# EAGLE design kombi_4x16Arelais01 (EAGLE 4.16)
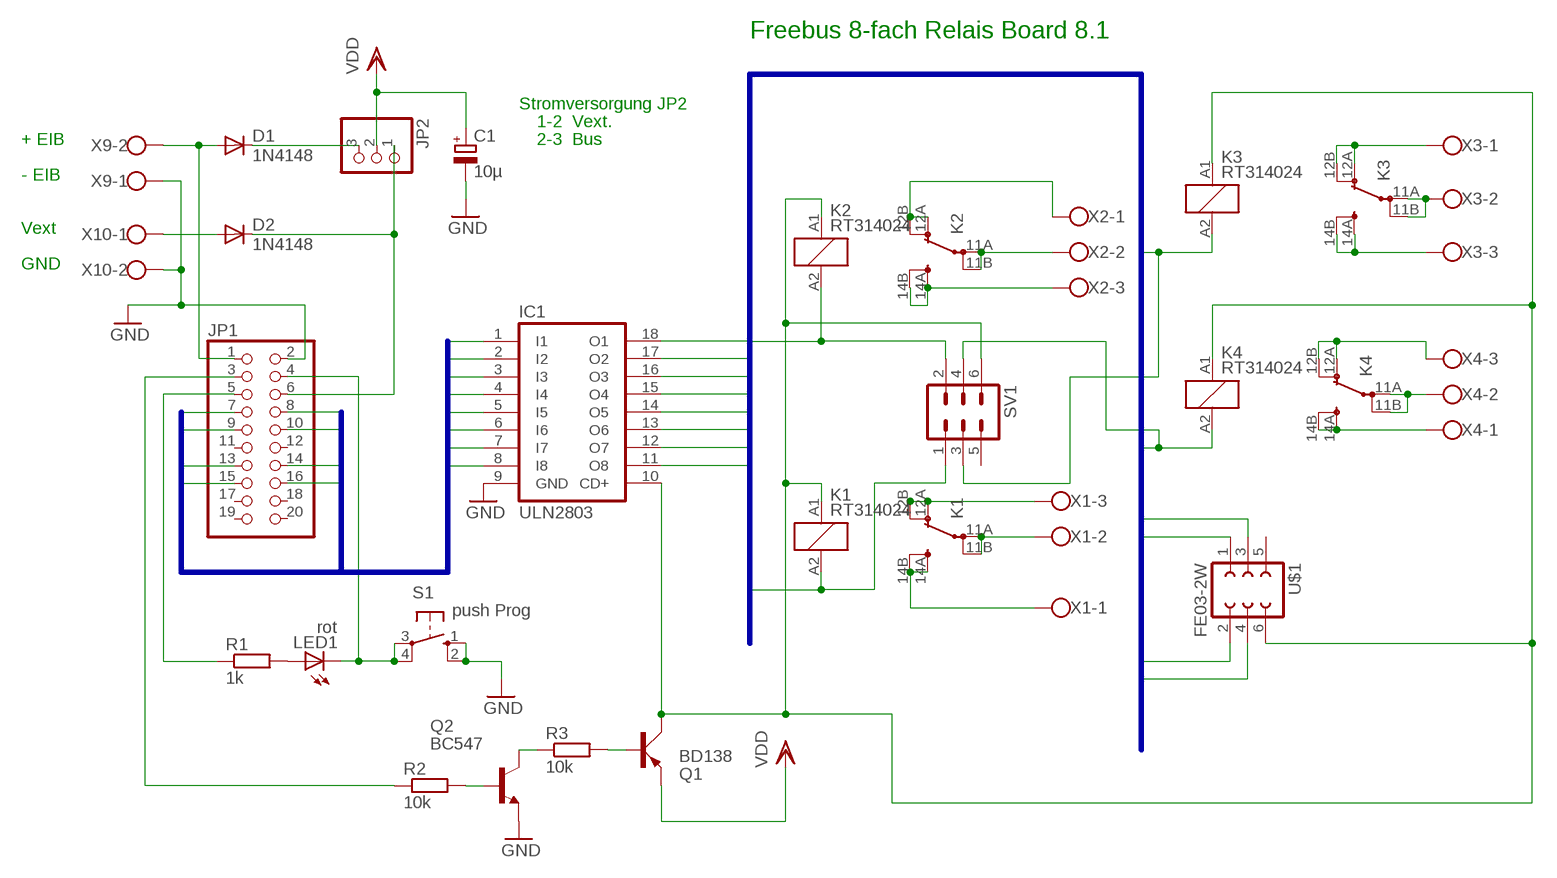
[diagram p0: schematic, sheet 1]

## Parts
C1  10µ  CPOL-EUE3.5-8  [E3,5-8]
D1  1N4148  [DO35-10]
D2  1N4148  [DO35-10]
IC1  ULN2803  ULN2803A  [DIL18]
JP1  PINHD-2X10  [2X10]
JP2  PINHD-1X3  [1X03]
K1  RT314024  [RT-C/O16A5]
K2  RT314024  [RT-C/O16A5]
K3  RT314024  [RT-C/O16A5]
K4  RT314024  [RT-C/O16A5]
LED1  rot  LED3MM  [LED3MM]
Q1  BD138  BD140  [TO126AV]
Q2  BC547  [TO92]
R1  1k  R-EU_0207/10  [0207/10]
R2  10k  R-EU_0207/10  [0207/10]
R3  10k  R-EU_0207/10  [0207/10]
S1  push Prog  10-XX  [B3F-10XX]
SV1  MA03-2LIEGEND  [MA03-2W]
U$1  FE03-2W  [FE03-2W]
X1  W237-03P  [W237-133]
X2  W237-03P  [W237-133]
X3  W237-03P  [W237-133]
X4  W237-03P  [W237-133]
X9  W237-102  [W237-102]
X10  W237-102  [W237-102]

## Nets
GND: C1.- IC1.9(GND) JP1.2 Q2.1(E) S1.1(S) S1.2(S1) X9.1 X10.2
IO1: IC1.1(I1) JP1.16
IO2: IC1.2(I2) JP1.15
IO3: IC1.3(I3) JP1.14
IO4: IC1.4(I4) JP1.13
IO5: IC1.5(I5) JP1.10
IO6: IC1.6(I6) JP1.9
IO7: IC1.7(I7) JP1.8
IO8: IC1.8(I8) JP1.7
N$7: K3.12A(2:OA) K3.12B(2:OB) X3.1
N$8: K4.14A(2:SA) K4.14B(2:SB) X4.1
N$9: K4.11A(2:PA) K4.11B(2:PB) X4.2
N$10: K4.12A(2:OA) K4.12B(2:OB) X4.3
N$11: K3.11A(2:PA) K3.11B(2:PB) X3.2
N$12: K3.14A(2:SA) K3.14B(2:SB) X3.3
N$13: K1.12A(2:OA) K1.12B(2:OB) X1.3
N$14: K1.11A(2:PA) K1.11B(2:PB) X1.2
N$15: K1.14A(2:SA) K1.14B(2:SB) X1.1
N$16: K2.14A(2:SA) K2.14B(2:SB) X2.3
N$17: D2.A X10.1
N$18: K2.11A(2:PA) K2.11B(2:PB) X2.2
N$19: K2.12A(2:OA) K2.12B(2:OB) X2.1
N$20: D1.A JP1.1 X9.2
N$24: JP1.5 R1.1
N$27: JP1.4 LED1.K(C) S1.3(P) S1.4(P1)
N$28: LED1.A R1.2
N$31: D2.C JP1.6 JP2.1
N$32: D1.C JP2.3
N$33: JP1.3 R2.1
N$37: Q1.B R3.2
N$38: Q2.3(C) R3.1
N$39: Q2.2(B) R2.2
PWM_RELAISE: IC1.10(CD+) K1.A1 K2.A1 K3.A1 K4.A1 Q1.C SV1.6 U$1.6
R1: IC1.14(O5) U$1.4
R2: IC1.13(O6) U$1.3
R3: IC1.12(O7) U$1.2
R4: IC1.11(O8) U$1.1
R5: IC1.15(O4) K4.A2 SV1.4
R6: IC1.16(O3) K3.A2 SV1.3
R7: IC1.17(O2) K2.A2 SV1.2
R8: IC1.18(O1) K1.A2 SV1.1
VDD: C1.+ JP2.2 Q1.E
Unconnected: JP1.11 JP1.12 JP1.17 JP1.18 JP1.19 JP1.20 SV1.5 U$1.5

## Buses
R[1..8]
IO[1..8]

## Notes on the sheet
- Freebus 8-fach Relais Board 8.1
- Stromversorgung JP2
- 1-2  Vext.
- + EIB | 2-3  Bus
- - EIB
- Vext
- GND

## Library data of the parts
C1 = rcl:CPOL-EU: POLARIZED CAPACITOR, European symbol
D1 D2 = diode:1N4148: DIODE high speed (Philips)
IC1 = uln-udn:ULN2803A: DRIVER ARRAY
JP1 = pinhead:PINHD-2X10: PIN HEADER
JP2 = pinhead:PINHD-1X3: PIN HEADER
K1-K4 = freebus_relay:RT31*: Power PCB Relayl SCHRACK 1 pole 12 / 16 A, DC- or AC-coi Source: http://www.schrack.com/.. 5819.pdf
LED1 = led:LED: LED OSRAM: - CHIPLED LG R971, LG N971, LY N971, LG Q971, LY Q971, LO R971, LY R971 LH N974, LH R974 LS Q976, LO Q976, LY Q976 LO Q996 - Hyper CHIPLED LW Q18S LB Q993, LB Q99A, LB R99A - SideLED LS A670, LO A670, LY A670, LG A670, LP A670 LB A673, LV A673, LT A673, LW A673 LH A674 LY A675 LS A676, LA A676, LO A676, LY A676, LW A676 LS A679, LY A679, LG A679 - Hyper Micro SIDELED® LS Y876, LA Y876, LO Y876, LY Y876 LT Y87S - SmartLED LW L88C, LW L88S LB L89C, LB L89S, LG L890 LS L89K, LO L89K, LY L89K LS L896, LA L896, LO L896, LY L896 - TOPLED LS T670, LO T670, LY T670, LG T670, LP T670 LSG T670, LSP T670, LSY T670, LOP T670, LYG T670 LG T671, LOG T671, LSG T671 LB T673, LV T673, LT T673, LW T673 LH T674 LS T676, LA T676, LO T676, LY T676, LB T676, LH T676, LSB T676, LW T676 LB T67C, LV T67C, LT T67C, LS T67K, LO T67K, LY T67K, LW E67C LS E67B, LA E67B, LO E67B, LY E67B, LB E67C, LV E67C, LT E67C LW T67C LS T679, LY T679, LG T679 LS T770, LO T770, LY T770, LG T770, LP T770 LB T773, LV T773, LT T773, LW T773 LH T774 LS E675, LA E675, LY E675, LS T675 LS T776, LA T776, LO T776, LY T776, LB T776 LHGB T686 LT T68C, LB T68C - Hyper Mini TOPLED® LB M676 - Mini TOPLED Santana® LG M470 LS M47K, LO M47K, LY M47K Source: http://www.osram.convergy.de - LUMILED® LXK2-PW12-R00, LXK2-PW12-S00, LXK2-PW14-U00, LXK2-PW14-V00 LXK2-PM12-R00, LXK2-PM12-S00, LXK2-PM14-U00 LXK2-PE12-Q00, LXK2-PE12-R00, LXK2-PE12-S00, LXK2-PE14-T00, LXK2-PE14-U00 LXK2-PB12-K00, LXK2-PB12-L00, LXK2-PB12-M00, LXK2-PB14-N00, LXK2-PB14-P00, LXK2-PB14-Q00 LXK2-PR12-L00, LXK2-PR12-M00, LXK2-PR14-Q00, LXK2-PR14-R00 LXK2-PD12-Q00, LXK2-PD12-R00, LXK2-PD12-S00 LXK2-PH12-R00, LXK2-PH12-S00 LXK2-PL12-P00, LXK2-PL12-Q00, LXK2-PL12-R00 Source: www.luxeon.com
Q1 = transistor-power:BD140: PNP TRANSISTOR
Q2 = transistor-npn:BC547*: NPN Transistor
R1-R3 = rcl:R-EU_: RESISTOR, European symbol
S1 = switch-omron:10-XX: OMRON SWITCH
SV1 = con-lstb:MA03-2: PIN HEADER
U$1 = con-lsta:FE03-2W
X1-X4 = con-wago-508:W237-03P: WAGO SREW CLAMP
X9 X10 = con-wago-500:W237-102: WAGO SCREW CLAMP

## Board
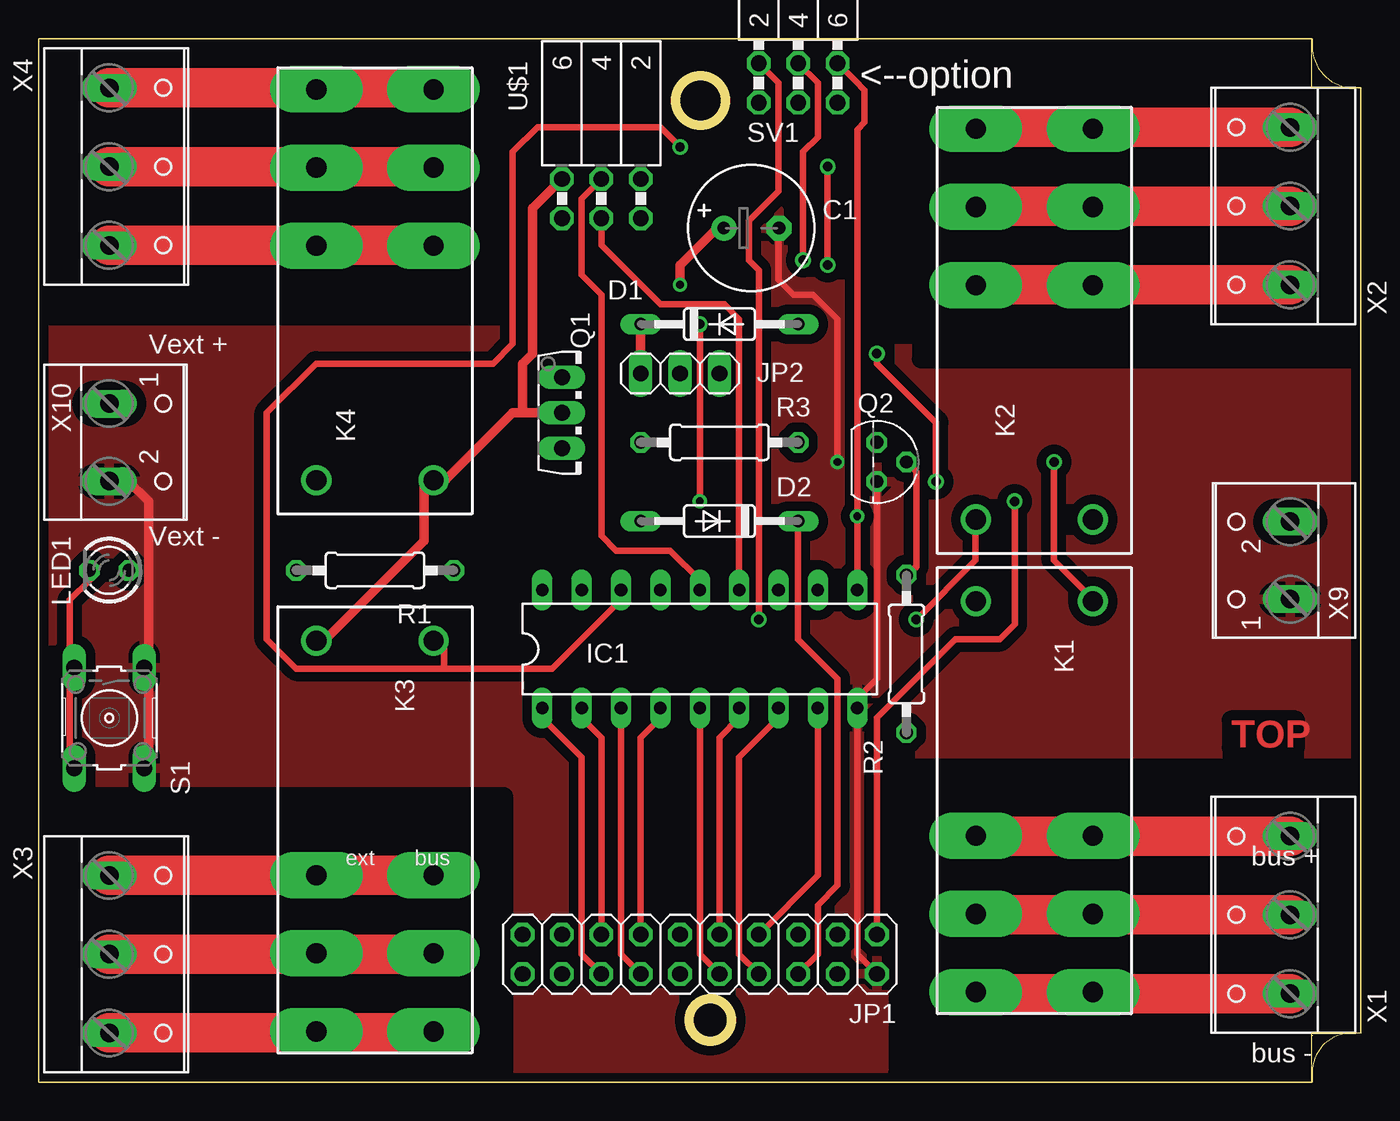
[diagram p1: board, top side]
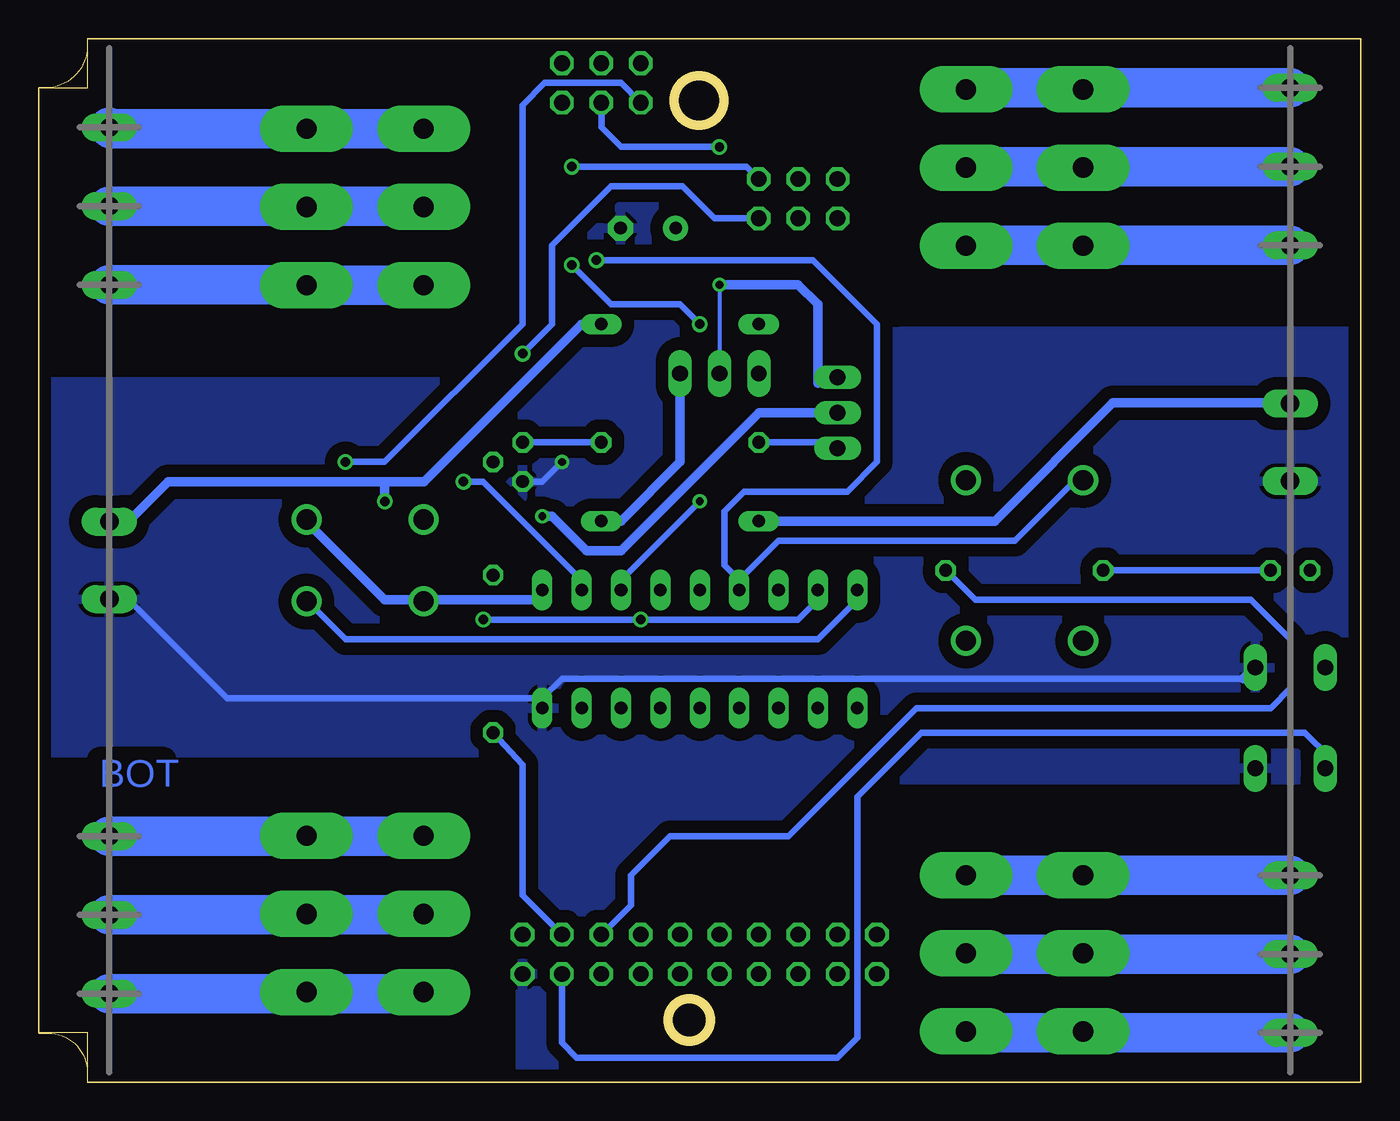
[diagram p2: board, bottom side, seen from below]

Size 85.3 x 67.3 mm. Coordinates in mm from the lower left corner, seen from the top.
Outline: 0,0.01 82.16,0 82.16,3.18 85.3,3.18 85.3,64.13 82.16,64.13 82.16,67.3 0,67.3 0,0.01
Outline: circle at 42.7,63.33 radius 1.59
Outline: circle at 43.33,4 radius 1.35
Copper layers (1*16): Top 0.035mm / dielectric 1.5mm / Bottom 0.035mm
Design rules "default": minimum track width 10mil, minimum drill 24mil, track to track 16mil, track to pad 12mil, pad to pad 16mil, via to via 16mil, smd to smd 8mil, copper to edge 20mil, drill to drill 10mil, minimum pad ring 10mil, minimum via ring 8mil, stop-mask expansion 4mil, vias tented up to drill 0mil, thermal gap 10mil
tRestrict: area -0.5,49.4 to 29.9,67.2; area 55.3,48.3 to 85.2,66.7; area 0.2,0.6 to 30,18.4; area 55.4,0.6 to 85.3,18.4; area 55.3,18.1 to 85.1,20.3; area 56.9,46.7 to 85.1,49.2
bRestrict: area -0.5,49.5 to 29.9,67.3; area 55.3,48.3 to 85.2,66.7; area 55.4,0.6 to 85.2,18.3; area 0,0.6 to 29.9,18.4; area 56.8,46.3 to 84.8,49.2; area 55.3,18 to 85.2,20.2
Milling: 15 lines

### Footprints (pad centres in the part's own frame; a part is rotated, then mirrored left to right if it is on the bottom)
E3,5-8 = drill 0.813 pad 1.6 round: + -1.778,0 | drill 0.813 pad 1.6 octagon: - 1.778,0
DO35-10 = drill 0.813 long: A 5.08,0; C -5.08,0
DIL18 = drill 0.813 long: 1 -10.16,-3.81; 2 -7.62,-3.81; 3 -5.08,-3.81; 4 -2.54,-3.81; 5 0,-3.81; 6 2.54,-3.81; 7 5.08,-3.81; 8 7.62,-3.81; 9 10.16,-3.81; 10 10.16,3.81; 11 7.62,3.81; 12 5.08,3.81; 13 2.54,3.81; 14 0,3.81; 15 -2.54,3.81; 16 -5.08,3.81; 17 -7.62,3.81; 18 -10.16,3.81
2X10 = drill 1.016 octagon: 1 -11.43,-1.27; 2 -11.43,1.27; 3 -8.89,-1.27; 4 -8.89,1.27; 5 -6.35,-1.27; 6 -6.35,1.27; 7 -3.81,-1.27; 8 -3.81,1.27; 9 -1.27,-1.27; 10 -1.27,1.27; 11 1.27,-1.27; 12 1.27,1.27; 13 3.81,-1.27; 14 3.81,1.27; 15 6.35,-1.27; 16 6.35,1.27; 17 8.89,-1.27; 18 8.89,1.27; 19 11.43,-1.27; 20 11.43,1.27
1X03 = drill 1.016 long: 1 -2.54,0; 2 0,0; 3 2.54,0
RT-C/O16A5 = drill 1.3 pad 3 long: 11A 7.56,3.78; 11B 7.56,-3.78; 12A 2.52,3.78; 12B 2.52,-3.78; 14A 12.6,3.78; 14B 12.6,-3.78 | drill 1.3 round: A1 -12.6,-3.78; A2 -12.6,3.78
LED3MM = drill 0.813 octagon: A -1.27,0; K 1.27,0
TO126AV = drill 1.016 long: B 2.286,-1.27; C 0,-1.27; E -2.286,-1.27
TO92 = drill 0.813 octagon: 1 1.27,0; 2 0,1.905; 3 -1.27,0
0207/10 = drill 0.813 octagon: 1 -5.08,0; 2 5.08,0
B3F-10XX = drill 1.016 long: 1 -3.251,2.261; 2 3.251,2.261; 3 -3.251,-2.261; 4 3.251,-2.261
MA03-2W = drill 1.016 octagon: 1 -2.54,-5.08; 2 -2.54,-2.54; 3 0,-5.08; 4 0,-2.54; 5 2.54,-5.08; 6 2.54,-2.54
FE03-2W = drill 1.016 octagon: 1 5.08,-5.08; 2 5.08,-2.54; 3 2.54,-5.08; 4 2.54,-2.54; 5 0,-5.08; 6 0,-2.54
W237-133 = drill 1.194 long: 1 -5.08,-0.635; 2 0,-0.635; 3 5.08,-0.635
W237-102 = drill 1.194 long: 1 -2.5,-1.27; 2 2.5,-1.27

### Placement (x,y rotation side)
C1  45.98,55.09 0 top
D1  43.92,48.89 0 top
D2  43.92,36.2 180 top
IC1  42.65,27.94 0 top
JP1  42.65,8.26 180 top
JP2  41.38,45.72 180 top
K1  64.24,18.42 270 top
K2  64.24,48.89 90 top
K3  21.7,15.88 270 top
K4  21.7,51.43 90 top
LED1  4.55,33.02 180 top
Q1  35.03,43.18 270 top
Q2  54.08,40 270 top
R1  21.7,33.02 180 top
R2  55.98,27.62 90 top
R3  43.92,41.27 180 top
S1  4.55,23.5 270 top
SV1  49,68.26 0 top
U$1  33.76,60.8 0 top
X1  80.11,10.79 90 top
X2  80.11,56.52 90 top
X3  5.18,8.26 270 top
X4  5.18,59.05 270 top
X9  79.48,33.66 90 top
X10  5.82,41.27 270 top

### Tracks (layer width: path | path; a pad name or v marks a point on that pad's centre or on a via)
GND  (via drill 0.5)
  Top 0.254: 7.09,26.35 S1.1 | IC1.9 52.81,24.77 | 47.73,55.24 C1.-
  Top 0.406: 52.81,24.77 54.08,26.04 Q2.1 | JP1.2 52.81,8.26 IC1.9 | 47.73,55.24 47.73,51.75 48.68,50.8 49.95,50.8 51.54,49.21 v51.54,40
  Top 0.61: 7.09,26.35 7.09,20.96 S1.2 | X10.2 5.82,38.73 7.09,37.46 7.09,27.31 S1.1
  Bottom 0.254: 79.48,31.12 X9.1
  Bottom 0.406: v51.54,40 52.81,38.73 Q2.1 | 79.48,31.12 73.13,24.77 52.81,24.77 | 7.57,26.04 51.54,26.04 52.81,24.77 | 52.81,24.77 IC1.9
  Bottom 0.61: S1.1 7.57,26.04
  pour Bottom (isolate 0.813): -1.15,67.31 85.83,67.31 86.47,66.68 86.47,-1.27 -1.23,-1.27
  pour Top (isolate 0.61): -0.53,67.79 85.83,67.79 85.83,-1.27 -1.17,-1.27 -1.17,67.95
IO1
  Top 0.406: JP1.16 35.03,8.26 35.03,20.96 32.49,23.5 IC1.1
IO2
  Top 0.406: JP1.15 36.3,22.23 35.03,23.5 IC1.2
IO3
  Top 0.406: JP1.14 37.57,8.26 IC1.3
IO4
  Top 0.406: JP1.13 38.84,22.23 40.11,23.5 IC1.4
IO5
  Top 0.406: JP1.10 42.65,8.26 IC1.5
IO6
  Top 0.406: JP1.9 43.92,22.23 45.19,23.5 IC1.6
IO7
  Top 0.406: JP1.8 45.19,8.26 45.19,20.96 47.73,23.5 IC1.7
IO8
  Top 0.406: JP1.7 50.27,13.33 IC1.8
N$7
  Top 2.54: X3.1 25.5,13.33
  Bottom 2.54: X3.1 17.89,13.33 K3.12B 17.93,13.33 25.49,13.33 | 25.49,13.33 25.5,13.33 | 25.49,13.33 K3.12A
N$8
  Top 2.54: X4.1 25.5,64.14
  Bottom 2.54: X4.1 17.91,64.14 | 25.47,64.14 25.5,64.14 | 25.47,64.14 K4.14B | 17.91,64.14 K4.14A | 17.91,64.14 25.47,64.14
N$9
  Top 2.54: X4.2 25.5,59.05
  Bottom 2.54: X4.2 17.91,59.05 | 25.47,59.05 25.5,59.05 | 25.47,59.05 K4.11B | 17.91,59.05 K4.11A | 17.91,59.05 25.47,59.05
N$10
  Top 2.54: X4.3 25.5,53.98
  Bottom 2.54: X4.3 17.91,53.98 | 25.47,53.98 25.5,53.98 | 25.47,53.98 K4.12B | 17.91,53.98 K4.12A | 17.91,53.98 25.47,53.98
N$11
  Top 2.54: X3.2 25.5,8.26
  Bottom 2.54: X3.2 17.91,8.26 | 25.47,8.26 25.5,8.26 | 25.47,8.26 K3.11A | 17.91,8.26 K3.11B | 17.91,8.26 25.47,8.26
N$12
  Top 2.54: X3.3 25.5,3.17
  Bottom 2.54: X3.3 17.88,3.17 17.88,3.25 K3.14B 18.02,3.17 25.5,3.17 25.5,3.25 K3.14A
N$13
  Top 2.54: X1.3 60.43,15.88
  Bottom 2.54: 68.05,15.88 X1.3 | 68.05,15.88 68.04,15.88 K1.12A | K1.12B 60.48,15.88 68.05,15.88
N$14
  Top 2.54: X1.2 60.43,10.79
  Bottom 2.54: K1.11B 60.52,10.79 68.05,10.79 68.05,10.82 K1.11A 68.08,10.79 X1.2
N$15
  Top 2.54: X1.1 60.43,5.71
  Bottom 2.54: K1.14B 60.56,5.71 68.05,5.71 68.05,5.79 K1.14A 68.12,5.71 X1.1
N$16
  Top 2.54: X2.3 60.43,61.59
  Bottom 2.54: 68.02,61.47 68.05,61.44 | 68.02,61.47 K2.14B 80.65,61.49 X2.3 | K2.14A 67.99,61.49 68.02,61.47
N$17
  Bottom 0.61: D2.A 23.6,36.2 15.98,43.81 5.82,43.81 X10.1
N$18
  Top 2.54: K2.11B 68.02,56.52 | 68.02,56.52 60.43,56.52 | X2.2 68.02,56.52
  Bottom 2.54: K2.11A 60.46,56.52 68.02,56.52 | 68.02,56.52 K2.11B | 68.02,56.52 X2.2
N$19
  Top 2.54: X2.1 60.43,51.43
  Bottom 0.406: K2.12B 68.05,51.43
  Bottom 2.54: K2.12A K2.12B | K2.12B | K2.12B 68.04,51.43 X2.1
N$20  (via drill 0.61)
  Top 0.406: JP1.1 54.08,23.5 59.16,28.58 62.02,28.58 62.97,29.53 v62.97,37.46
  Bottom 0.61: 62.97,38.73 76.94,38.73 79.48,36.2 X9.2 | 62.97,38.73 60.43,38.73 50.27,48.89 D1.A | v62.97,37.46 62.97,38.73
N$24
  Bottom 0.406: JP1.5 47.09,11.43 47.09,13.33 44.55,15.88 36.94,15.88 28.68,24.13 5.82,24.13 4.55,25.4 4.55,28.58 7.09,31.12 24.87,31.12 R1.1
N$27
  Top 0.254: 3.28,32.38 LED1.K | 2.01,27.31 S1.3 2.01,26.04 | S1.4 2.01,20.96
  Top 0.406: 3.28,32.38 2.01,31.12 2.01,27.31 | 2.01,20.96 2.01,26.04
  Bottom 0.254: S1.4 2.01,20.96
  Bottom 0.406: JP1.4 51.54,2.54 50.59,1.59 33.76,1.59 32.49,2.86 32.49,18.42 28.36,22.54 3.6,22.54 2.01,20.96
N$28
  Bottom 0.406: LED1.A R1.2
N$31
  Top 0.406: JP1.6 50.27,8.26 50.27,11.43 51.54,12.7 51.54,26.04 49,28.58 D2.C
  Bottom 0.254: D2.C 47.73,36.2
  Bottom 0.61: 47.73,36.2 43.92,40 JP2.1
N$32
  Top 0.61: JP2.3 D1.C
N$33
  Bottom 0.406: JP1.3 54.08,12.06 54.08,20.48 R2.1
N$37
  Bottom 0.406: R3.2 35.03,41.27 Q1.B
N$38
  Bottom 0.406: R3.1 Q2.3
N$39
  Top 0.406: R2.2 56.62,33.25 56.62,39.37 Q2.2
PWM_RELAISE  (via drill 0.5)
  Top 0.406: K3.A1 18.52,28.58 | SV1.6 52.65,64.61 53.29,63.98 53.29,61.91 52.81,61.44 v52.81,36.51 IC1.10
  Top 0.61: 31.22,43.18 30.58,43.18 26.3,38.89 K4.A1 24.87,38.73 24.87,34.92 18.52,28.58 | 31.22,43.18 Q1.C | 31.22,43.18 31.22,46.35 31.85,46.99 31.85,56.36 U$1.6
  Bottom 0.254: IC1.10 52.81,31.12 | 68.05,36.2 K2.A1 | 60.43,31.12 K1.A1
  Bottom 0.61: 52.81,31.12 60.43,31.12 62.97,31.12 68.05,36.2 | Q1.C 38.84,43.18 47.73,34.29 49.95,34.29 52.17,36.51 v52.81,36.51
R1
  Top 0.406: IC1.14 42.65,32.38 40.74,34.29 37.25,34.29 36.3,35.24 36.3,50.8 35.03,52.07 35.03,56.99 U$1.4
R2
  Top 0.406: IC1.13 45.19,49.21 44.24,50.16 40.11,50.16 36.3,53.98 U$1.3
R3  (via drill 0.5, 0.61)
  Top 0.406: v42.65,37.46 v42.65,48.89 | v50.91,52.7 v50.91,59.05
  Bottom 0.406: v42.65,37.46 47.73,32.38 IC1.12 | v42.65,48.89 43.92,50.16 48.37,50.16 v50.91,52.7 | v50.91,59.05 39.63,59.05 U$1.2
R4  (via drill 0.61)
  Top 0.406: v57.89,38.73 57.89,42.54 54.08,46.35 v54.08,46.99
  Bottom 0.406: v57.89,38.73 56.62,38.73 50.27,32.38 IC1.11 | v54.08,46.99 52.17,48.89 52.17,53.98 48.37,57.78 43.76,57.78 41.7,55.72 U$1.1
R5  (via drill 0.61)
  Top 0.406: v49.32,53.02 49.32,60.01 50.27,60.96 50.27,64.45 SV1.4 | K4.A2 18.52,38.73
  Bottom 0.254: K4.A2 18.52,38.73
  Bottom 0.406: 40.11,32.38 37.57,34.92 22.33,34.92 18.52,38.73 | 40.11,32.38 IC1.15 | v49.32,53.02 35.35,53.02 31.22,48.89 31.22,40 33.12,38.1 39.79,38.1 41.06,36.83 41.06,33.34 40.11,32.38
R6  (via drill 0.6)
  Top 0.406: 26.14,26.67 26.14,28.58 K3.A2 | 26.14,26.67 33.12,26.67 37.57,31.12 IC1.16 | v41.38,60.32 40.11,61.59 32.17,61.59 30.58,60.01 30.58,47.62 29.31,46.35 17.88,46.35 14.71,43.18 14.71,28.58 16.61,26.67 26.14,26.67
  Bottom 0.406: v41.38,60.32 47.73,60.32 49,61.59 SV1.3
R7  (via drill 0.61)
  Top 0.254: 60.43,36.2 K2.A2
  Top 0.406: v56.62,29.85 60.43,33.66 60.43,36.2 | SV1.2 47.73,64.45 47.73,57.47 45.82,55.56 45.82,53.02 46.46,52.39 v46.46,29.85
  Bottom 0.406: v56.62,29.85 v46.46,29.85 36.3,29.85 35.03,31.12 IC1.17
R8  (via drill 0.61)
  Top 0.254: K1.A2 68.05,31.12
  Top 0.406: v65.51,40 65.51,33.66 68.05,31.12
  Bottom 0.254: 68.05,31.12 K1.A2
  Bottom 0.406: 68.05,31.12 65.51,28.58 35.03,28.58 32.49,31.12 IC1.18 | v65.51,40 62.97,40 54.08,48.89 54.08,63.02 52.65,64.45 47.73,64.45 SV1.1
VDD  (via drill 0.5)
  Top 0.61: v41.38,51.43 41.38,52.7 43.92,55.24 C1.+
  Bottom 0.254: v41.38,51.43 JP2.2
  Bottom 0.61: v41.38,51.43 36.3,51.43 35.03,50.16 35.03,45.09 Q1.E

### Text on the board
Top: TOP
Bottom: BOT
tPlace: <--option | Vext + | Vext - | ext | bus | bus + | bus -